# EAGLE design controller (EAGLE 9.5.2)

## Sheet 1 of 2
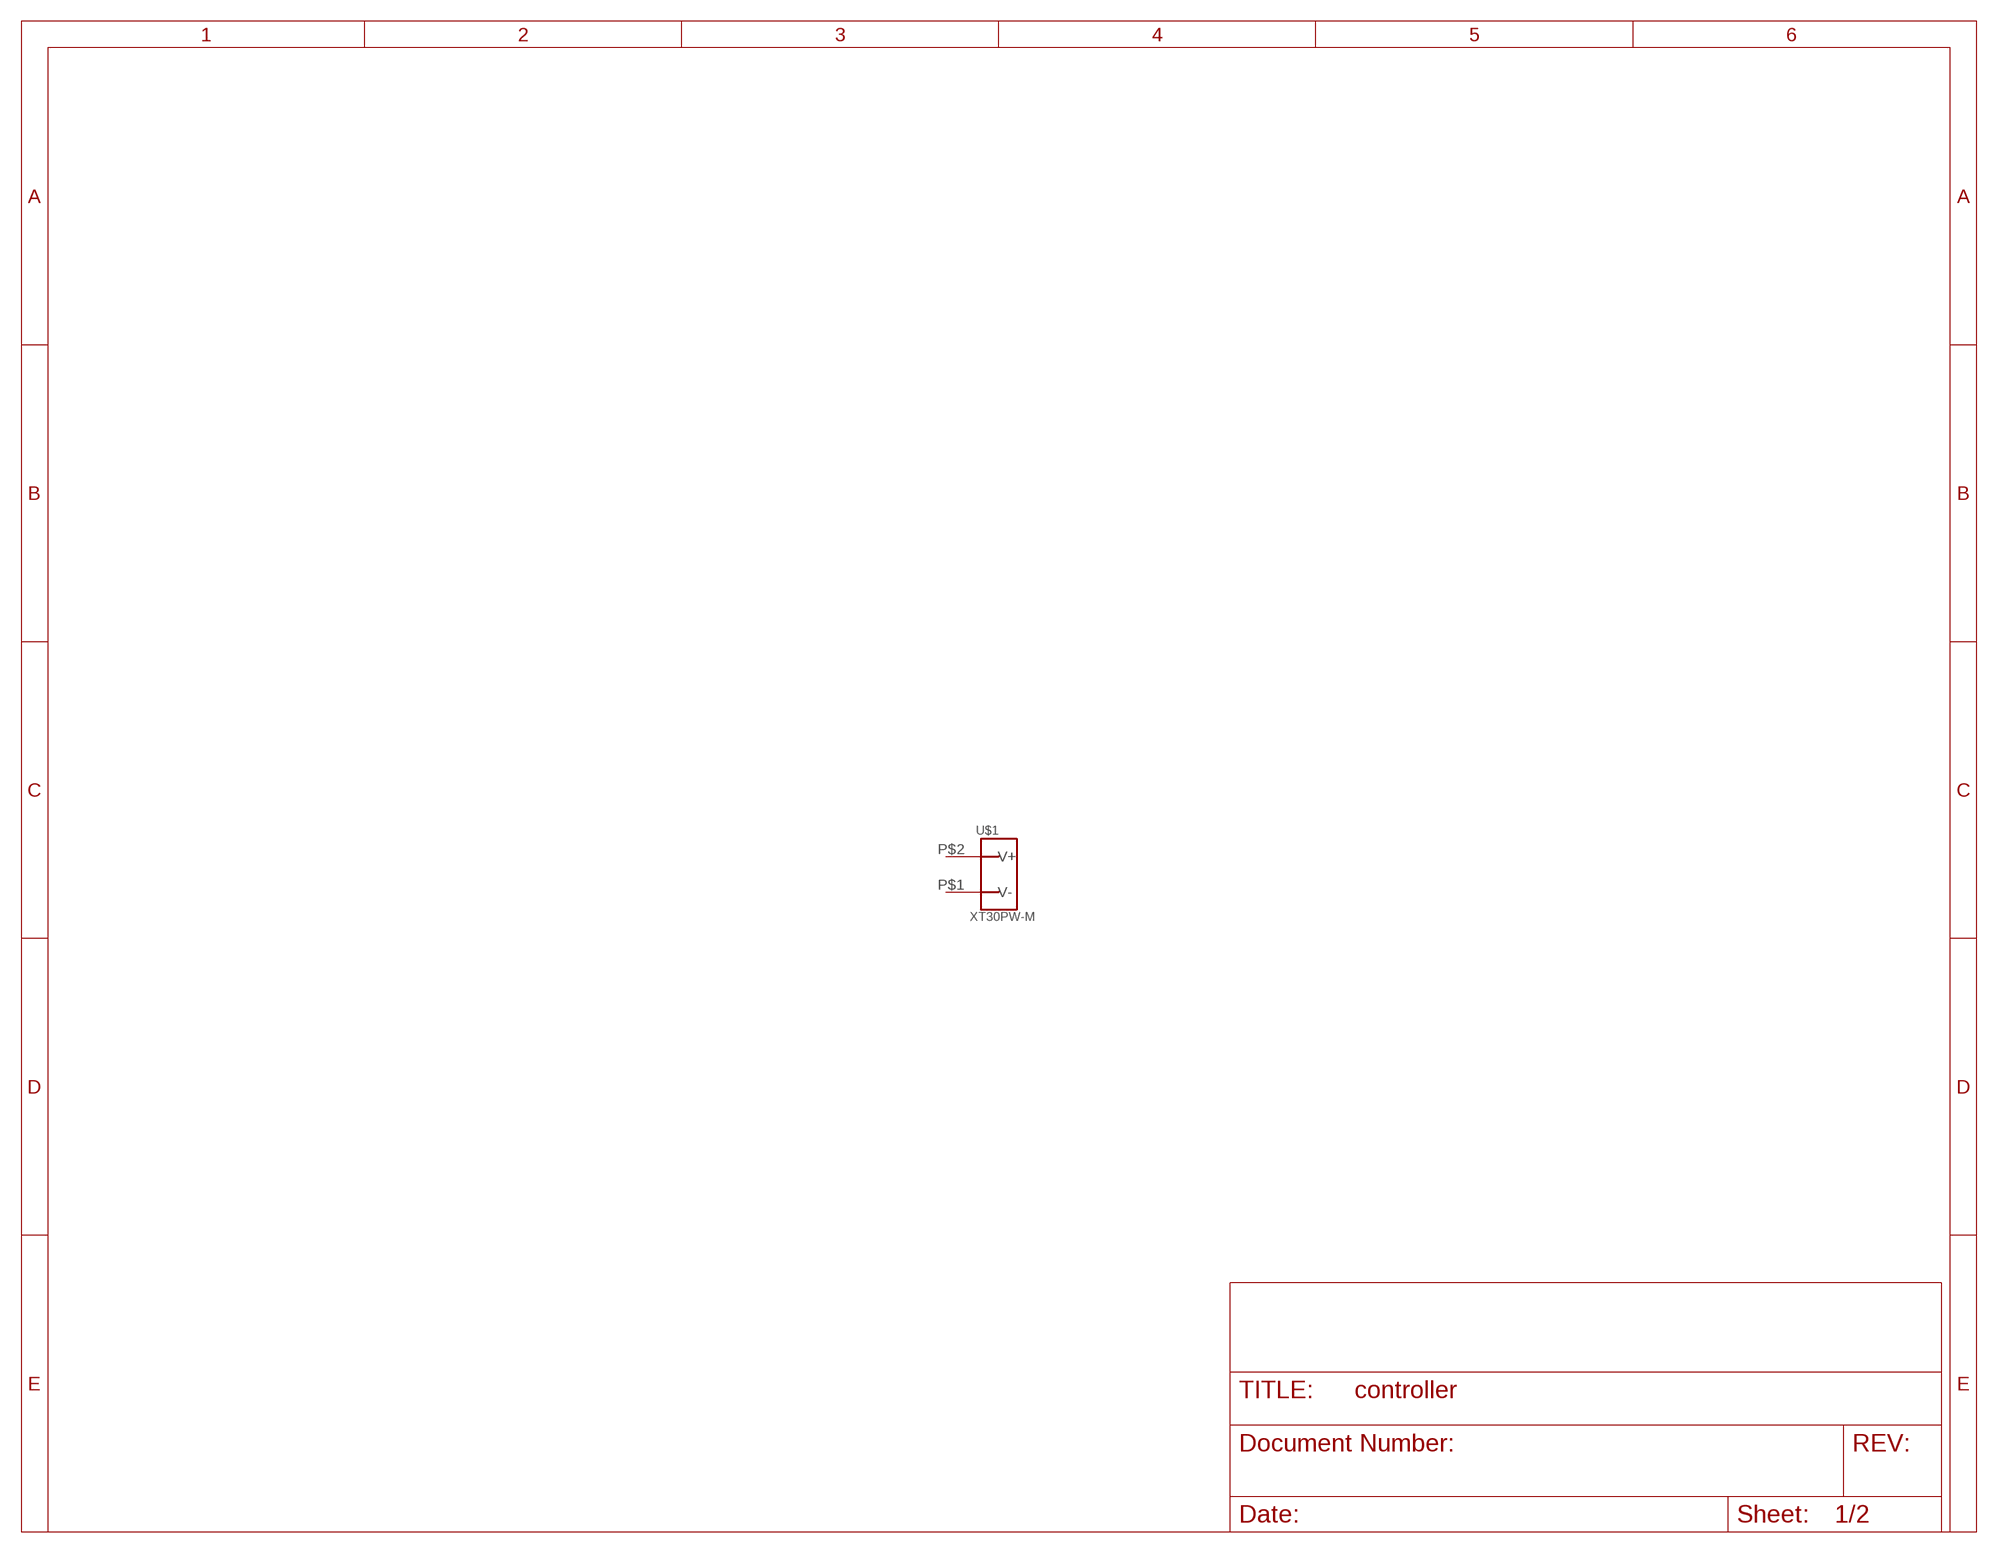
[diagram p0: schematic, sheet 1]

### Parts
U$1  XT30PW-M  [XT30PW-M]
Unconnected: U$1.P$1(V-) U$1.P$2(V+)

## Sheet 2 of 2
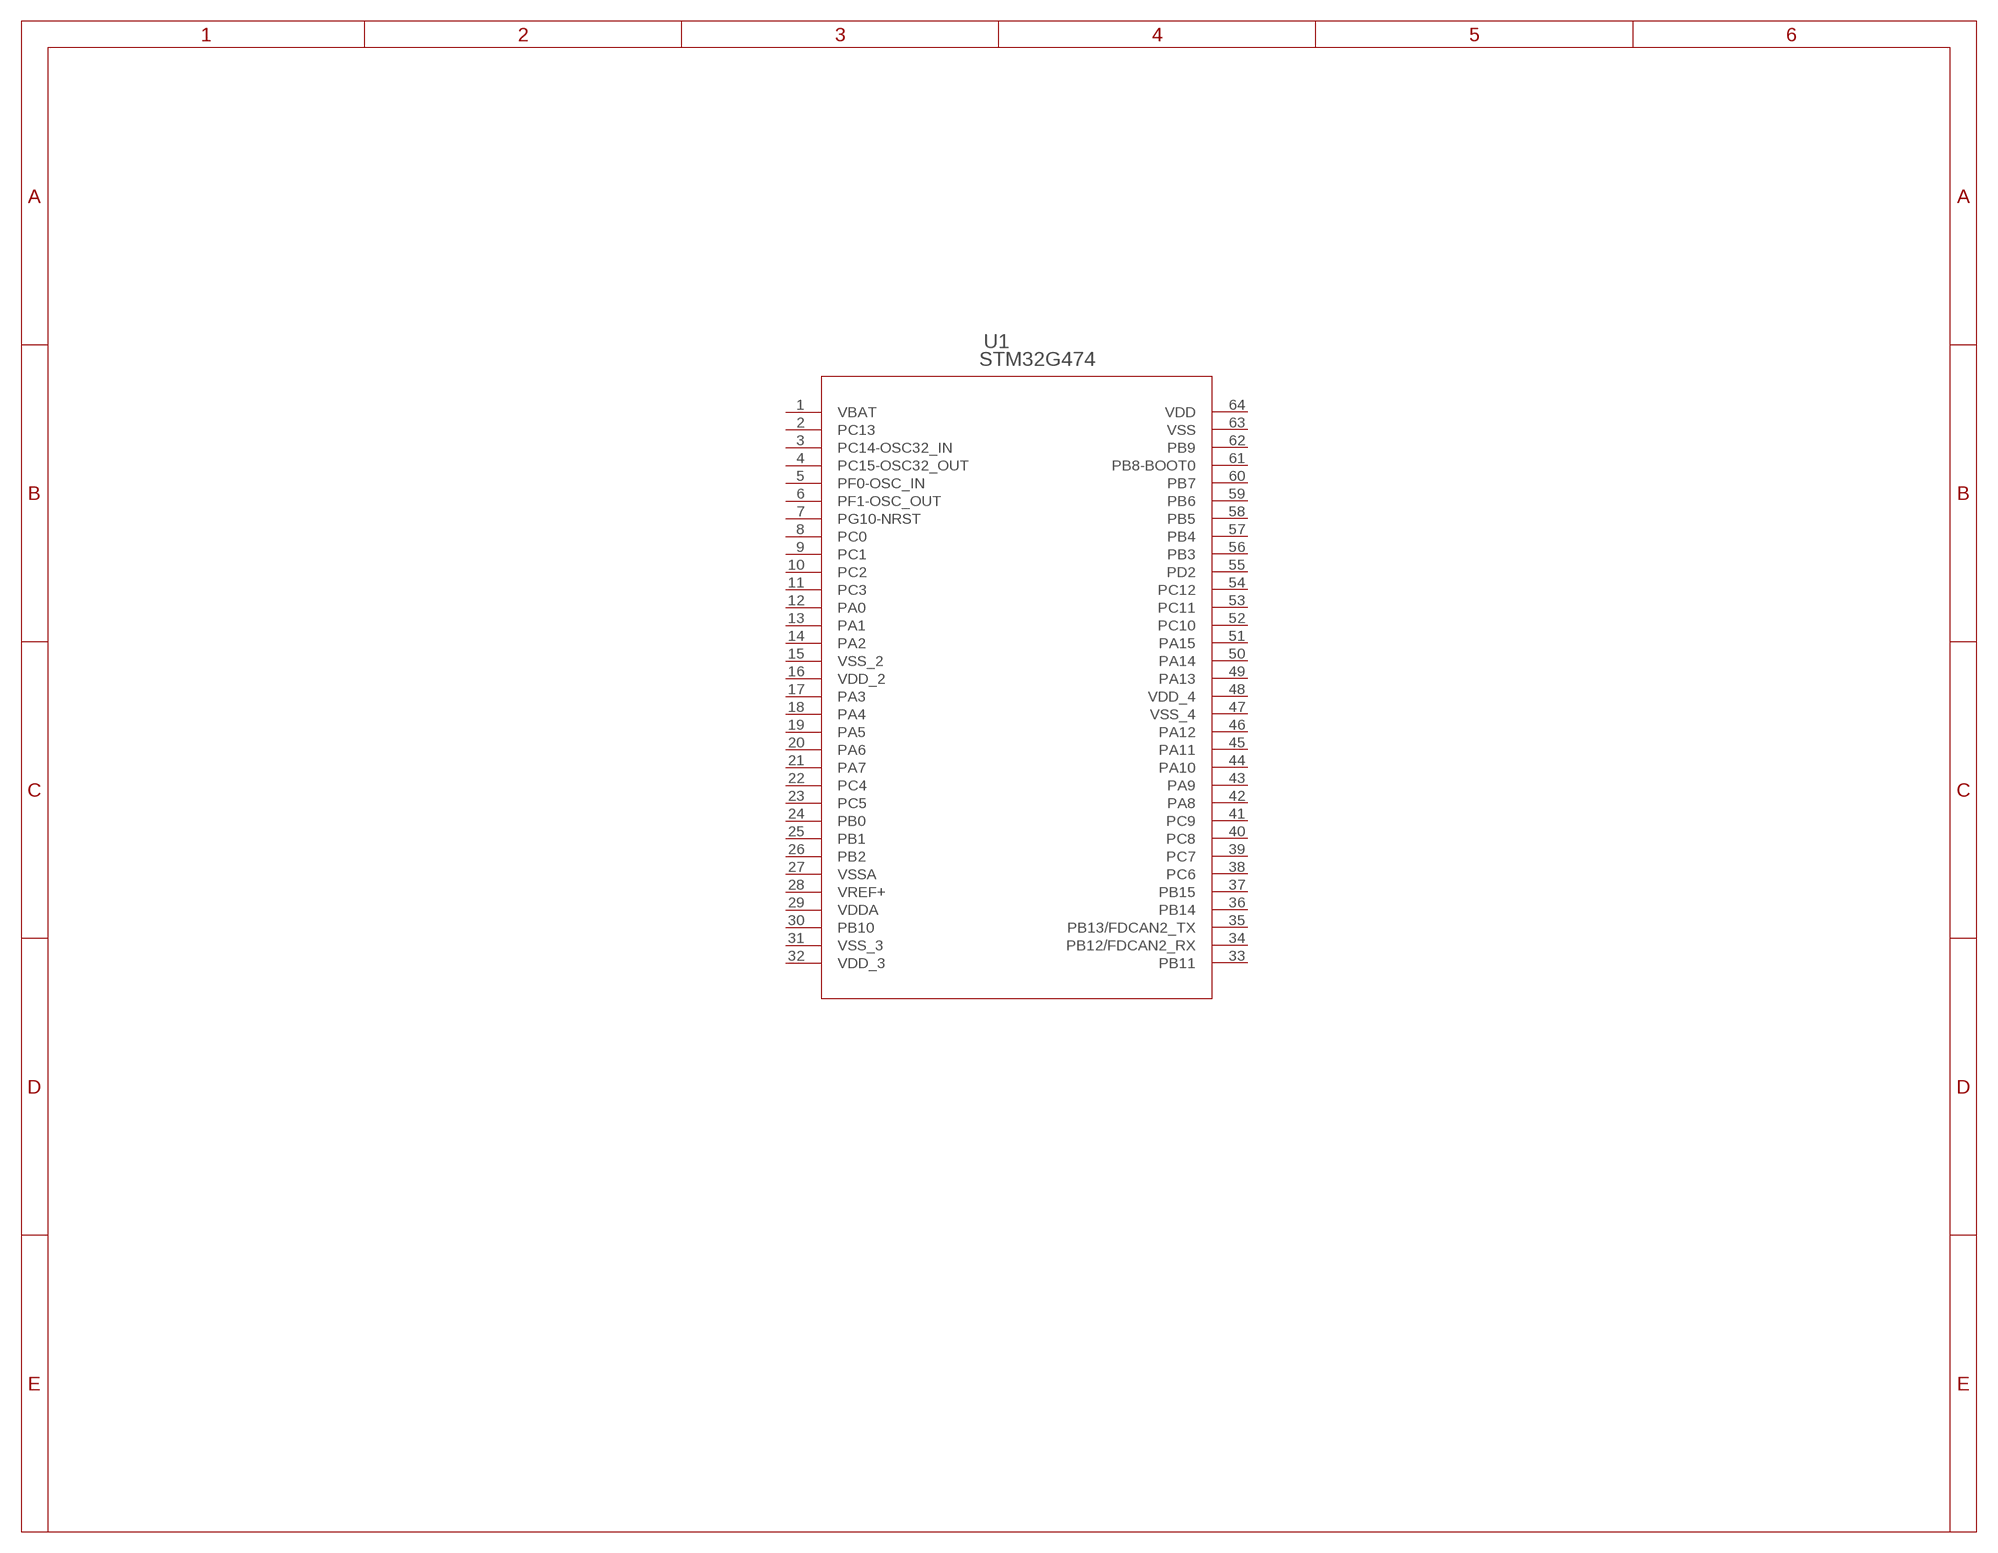
[diagram p1: schematic, sheet 2]

### Parts
U1  STM32G474  [LQFP-64]
Unconnected: U1.2(PC13) U1.3(PC14-OSC32_IN) U1.4(PC15-OSC32_OUT) U1.5(PF0-OSC_IN) U1.6(PF1-OSC_OUT) U1.7(PG10-NRST) U1.8(PC0) U1.9(PC1) U1.10(PC2) U1.11(PC3) U1.12(PA0) U1.13(PA1) U1.14(PA2) U1.17(PA3) U1.18(PA4) U1.19(PA5) U1.20(PA6) U1.21(PA7) U1.22(PC4) U1.23(PC5) U1.24(PB0) U1.25(PB1) U1.26(PB2) U1.30(PB10) U1.33(PB11) U1.34(PB12/FDCAN2_RX) U1.35(PB13/FDCAN2_TX) U1.36(PB14) U1.37(PB15) U1.38(PC6) U1.39(PC7) U1.40(PC8) U1.41(PC9) U1.42(PA8) U1.43(PA9) U1.44(PA10) U1.45(PA11) U1.46(PA12) U1.49(PA13) U1.50(PA14) U1.51(PA15) U1.52(PC10) U1.53(PC11) U1.54(PC12) U1.55(PD2) U1.56(PB3) U1.57(PB4) U1.58(PB5) U1.59(PB6) U1.60(PB7) U1.61(PB8-BOOT0) U1.62(PB9)

## Power pins joined to a net without a drawn wire
VBAT: U1.1(VBAT)
VDD: U1.64(VDD)
VDD_2: U1.16(VDD_2)
VDD_3: U1.32(VDD_3)
VDD_4: U1.48(VDD_4)
VDDA: U1.29(VDDA)
VREF+: U1.28(VREF+)
VSS: U1.63(VSS)
VSS_2: U1.15(VSS_2)
VSS_3: U1.31(VSS_3)
VSS_4: U1.47(VSS_4)
VSSA: U1.27(VSSA)

## Library data of the parts
U1 = timlib:STM32G474: Datasheet; BUILT_BY: EMA_Jessica; COPYRIGHT: Copyright (C) 2018 Accelerated Designs. All rights reserved; MANUFACTURER_PART_NUMBER: STM32G474RBT3; VENDOR: STMicroelectronics
U$1 = timlib:XT30PW

## Board
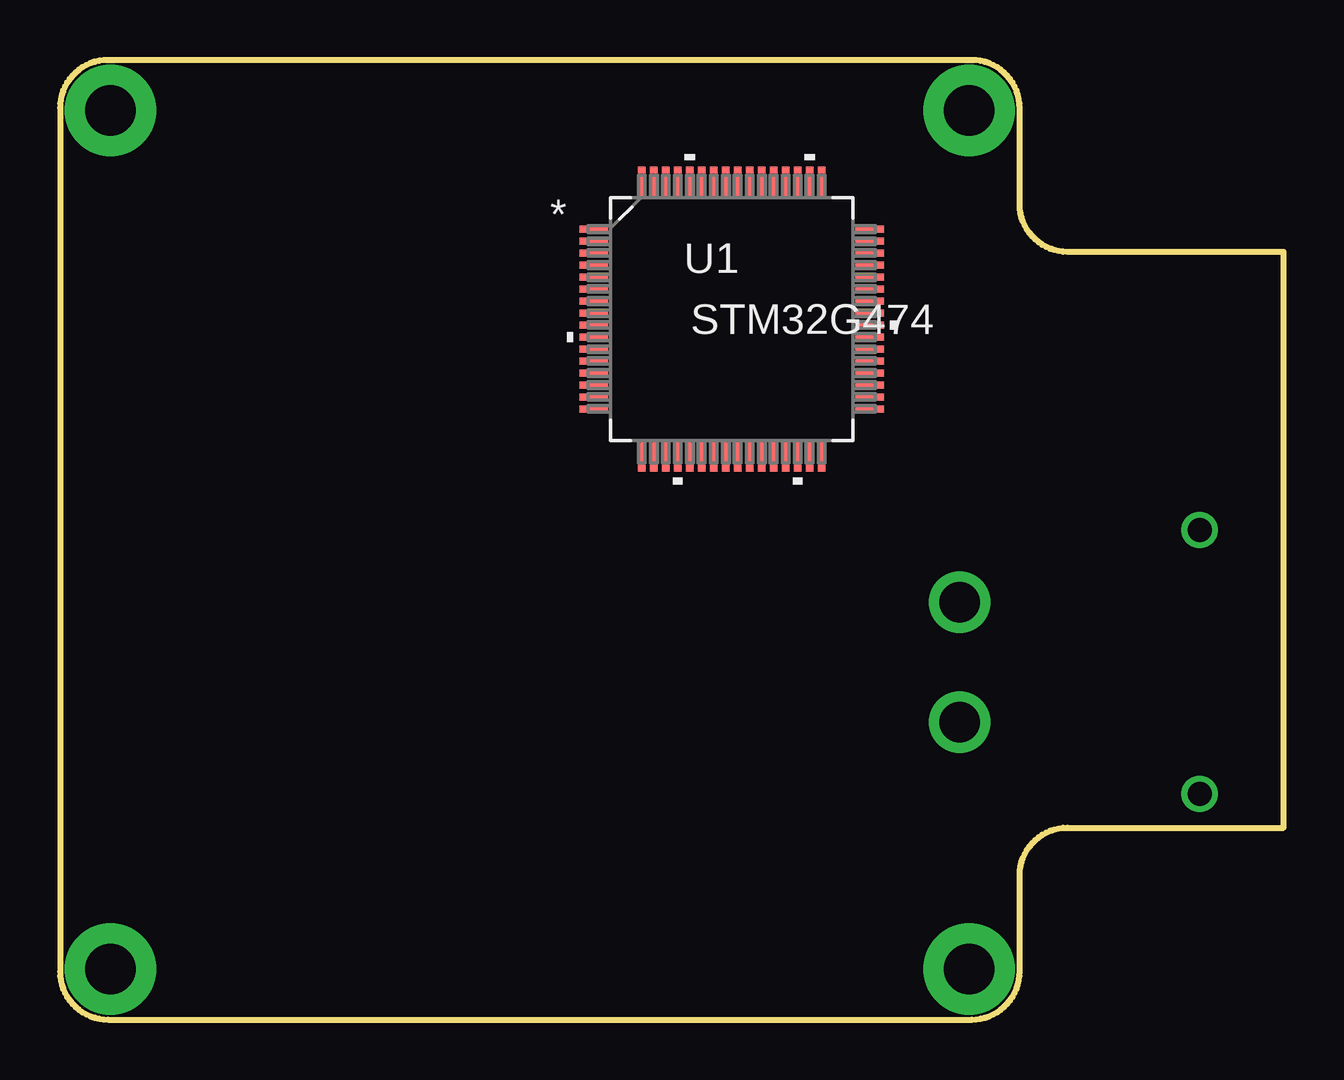
[diagram p2: board, top side]
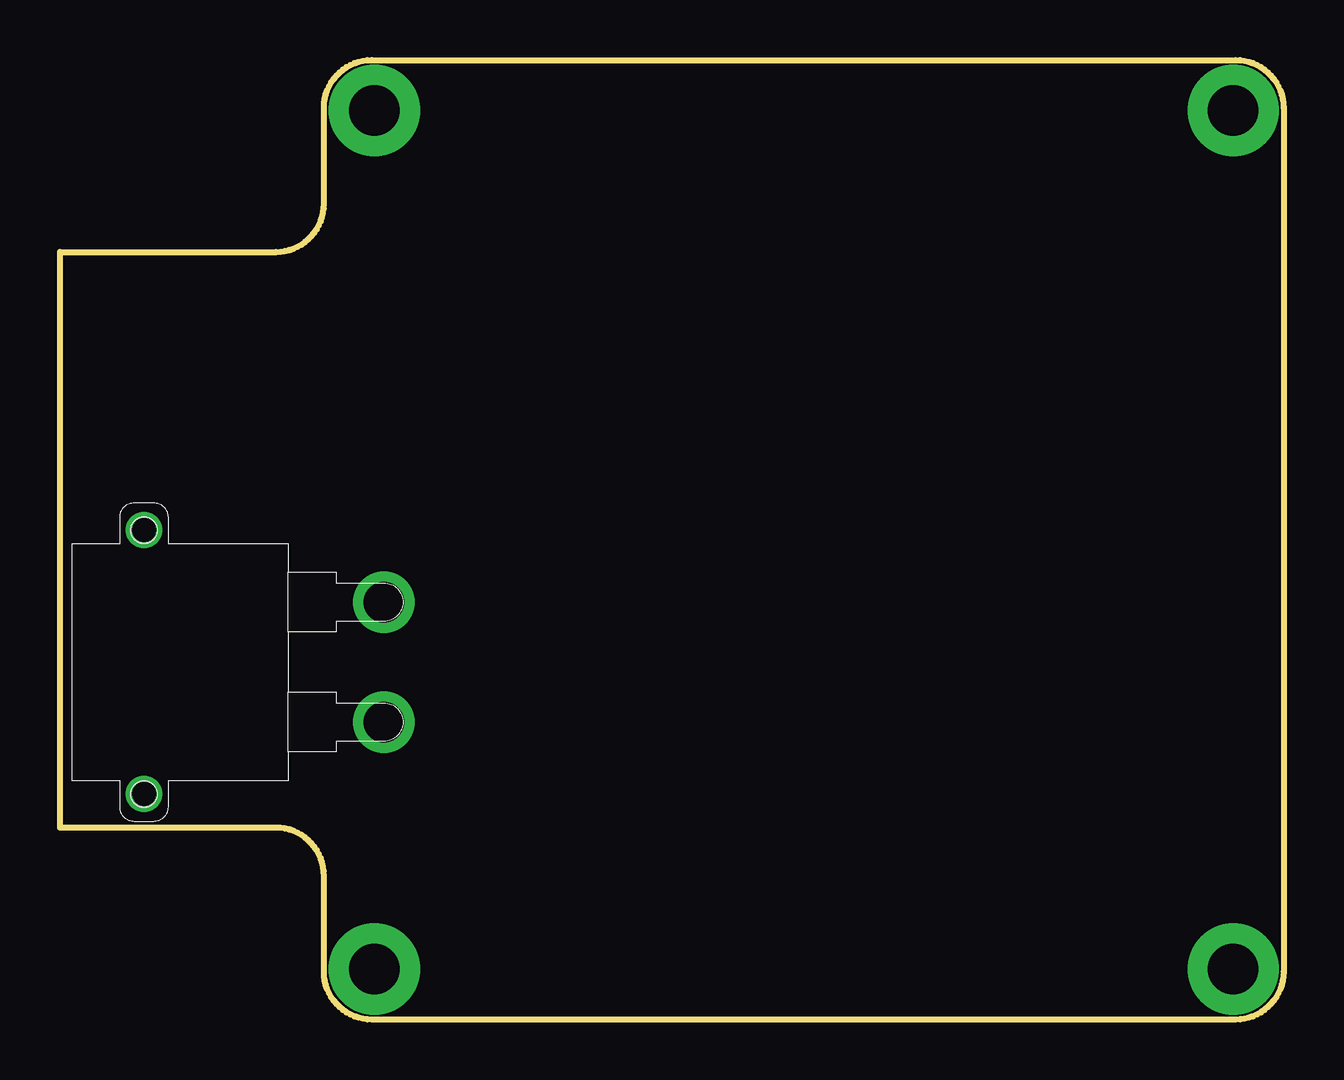
[diagram p3: board, bottom side, seen from below]

Size 51 x 40 mm. Coordinates in mm from the lower left corner, seen from the top.
Outline: 40,34 40,38 arc90 38,40 2,40 arc90 0,38 0,2 arc90 2,0 38,0 arc90 40,2 40,6 arc-90 42,8 51,8 51,32 42,32 arc-90 40,34
Copper layers (1*16): Top 0.035mm / dielectric 1.5mm / Bottom 0.035mm
Design rules "default *": minimum track width 6mil, minimum drill 0.35mm, track to track 6mil, track to pad 6mil, pad to pad 6mil, via to via 6mil, smd to smd 6mil, copper to edge 0.00508125mm, drill to drill 6mil, minimum pad ring 10mil, minimum via ring 8mil, stop-mask expansion 4mil, vias tented up to drill 0mil, thermal gap 10mil

### Footprints (pad centres in the part's own frame; a part is rotated, then mirrored left to right if it is on the bottom)
LQFP-64 = smd 1.2 x 0.3: 1 -5.75,3.75; 2 -5.75,3.25; 3 -5.75,2.75; 4 -5.75,2.25; 5 -5.75,1.75; 6 -5.75,1.25; 7 -5.75,0.75; 8 -5.75,0.25; 9 -5.75,-0.25; 10 -5.75,-0.75; 11 -5.75,-1.25; 12 -5.75,-1.75; 13 -5.75,-2.25; 14 -5.75,-2.75; 15 -5.75,-3.25; 16 -5.75,-3.75; 33 5.75,-3.75; 34 5.75,-3.25; 35 5.75,-2.75; 36 5.75,-2.25; 37 5.75,-1.75; 38 5.75,-1.25; 39 5.75,-0.75; 40 5.75,-0.25; 41 5.75,0.25; 42 5.75,0.75; 43 5.75,1.25; 44 5.75,1.75; 45 5.75,2.25; 46 5.75,2.75; 47 5.75,3.25; 48 5.75,3.75 | smd 0.3 x 1.2: 17 -3.75,-5.75; 18 -3.25,-5.75; 19 -2.75,-5.75; 20 -2.25,-5.75; 21 -1.75,-5.75; 22 -1.25,-5.75; 23 -0.75,-5.75; 24 -0.25,-5.75; 25 0.25,-5.75; 26 0.75,-5.75; 27 1.25,-5.75; 28 1.75,-5.75; 29 2.25,-5.75; 30 2.75,-5.75; 31 3.25,-5.75; 32 3.75,-5.75; 49 3.75,5.75; 50 3.25,5.75; 51 2.75,5.75; 52 2.25,5.75; 53 1.75,5.75; 54 1.25,5.75; 55 0.75,5.75; 56 0.25,5.75; 57 -0.25,5.75; 58 -0.75,5.75; 59 -1.25,5.75; 60 -1.75,5.75; 61 -2.25,5.75; 62 -2.75,5.75; 63 -3.25,5.75; 64 -3.75,5.75
XT30PW-M = drill 1.7: P$1 -2.5,10; P$2 2.5,10 | drill 1: P$3 5.5,0; P$4 -5.5,0

### Placement (x,y rotation side)
U1  28,29.2 0 top
U$1  47.5,14.9 270 bottom

### Tracks (layer width: path | path; a pad name or v marks a point on that pad's centre or on a via)
S$1  (via drill 2.1 pad 3.8)
  other vias: 2.1,37.9
S$2  (via drill 2.1 pad 3.8)
  other vias: 37.9,37.9
S$3  (via drill 2.1 pad 3.8)
  other vias: 2.1,2.1
S$4  (via drill 2.1 pad 3.8)
  other vias: 37.9,2.1